# Altium schematic sheet sch_alim.SchDoc: Gestion des alimentations
size A4; CheckedBy: Q.V. Nguyen; Author: Q.V. Nguyen, C. Demasson; DrawnBy: Q.V. Nguyen, C. Demasson; Organization: CNES; DocumentNumber: 1; Revision: 0; SheetNumber: 1; SheetTotal: 4
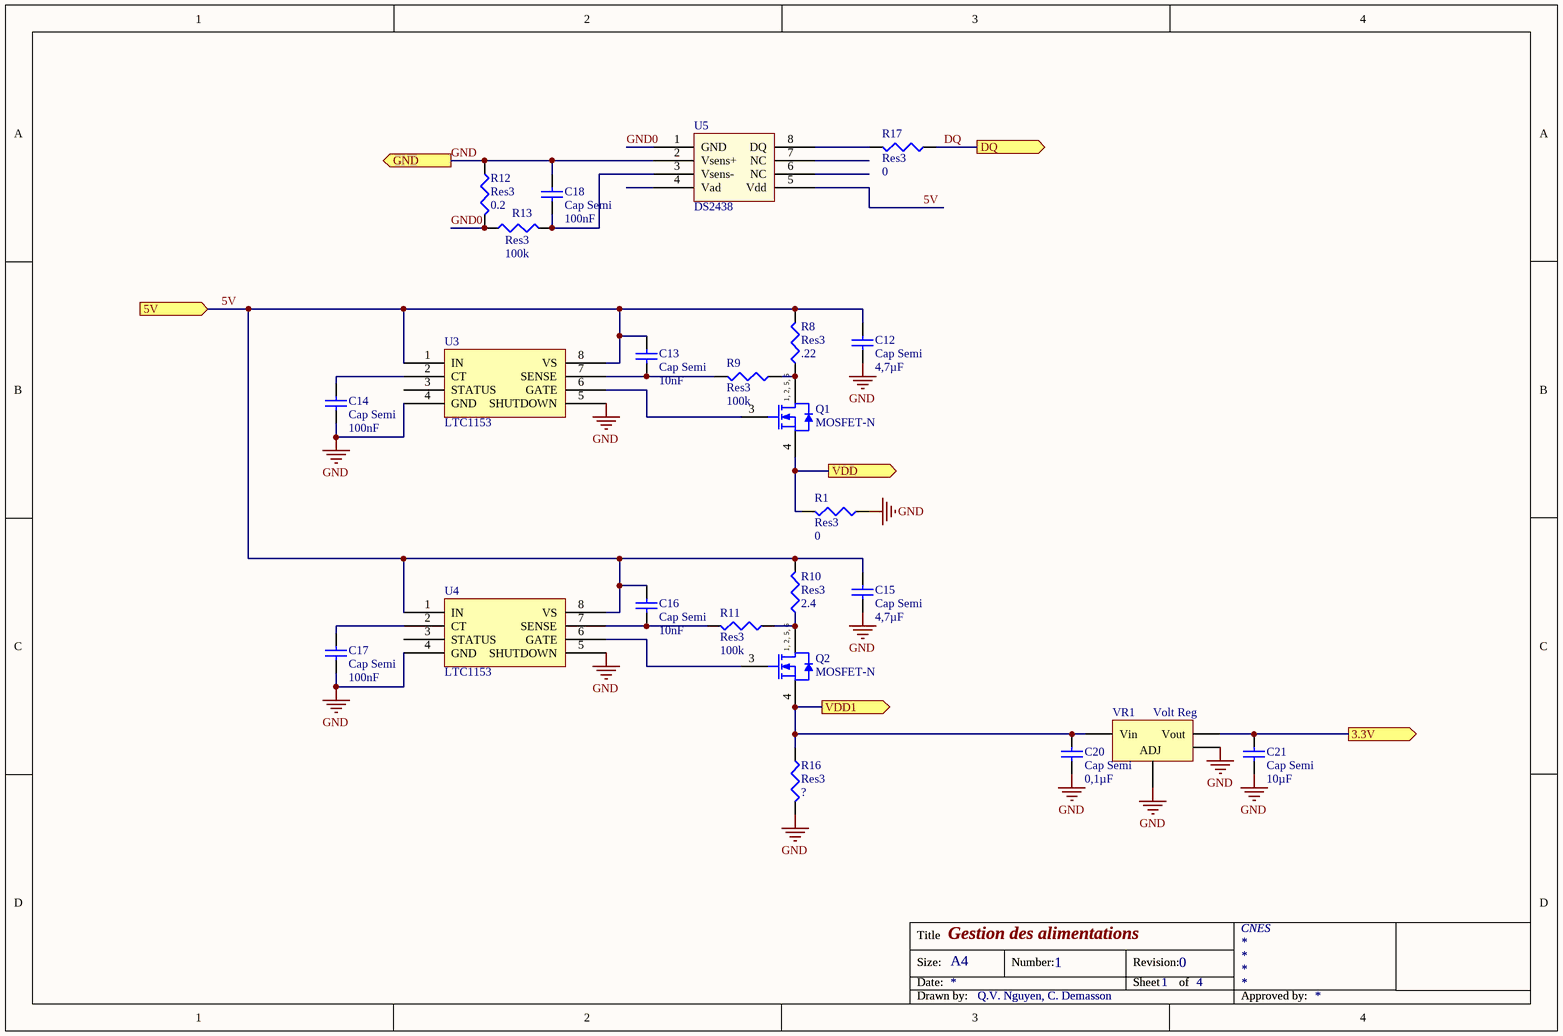
[diagram p0: sch_alim.SchDoc]

## Parts
C12  Cap Semi  value 4,7µF  [C1206]
C13  Cap Semi  value 10nF  [C1206]
C14  Cap Semi  value 100nF  [C1206]
C15  Cap Semi  value 4,7µF  [C1206]
C16  Cap Semi  value 10nF  [C1206]
C17  Cap Semi  value 100nF  [C1206]
C18  Cap Semi  value 100nF  [C1206]
C20  Cap Semi  value 0,1µF  [C1206]
C21  Cap Semi  value 10µF  [C1206]
Q1  MOSFET-N  [ONSC-SC70-6-419B-02_V]
Q2  MOSFET-N  [ONSC-SC70-6-419B-02_V]
R1  Res3  value 0  [C1206]
R8  Res3  value .22  [C1206]
R9  Res3  value 100k  [C1206]
R10  Res3  value 2.4  [C1206]
R11  Res3  value 100k  [C1206]
R12  Res3  value 0.2  [C1206]
R13  Res3  value 100k  [C1206]
R16  Res3  [C1206]
R17  Res3  value 0  [C1206]
U3  LTC1153  [S8 Package]
U4  LTC1153  [S8 Package]
U5  DS2438  [SO8_N]
VR1  Volt Reg  [Reg_LM317]

## Ports
3.3V (out), 5V (in), DQ (out), GND (out), VDD1 (out), VDD (out)

## Nets
GND: C12.2 C14.2 C15.2 C17.2 C18.1 C20.2 C21.2 R1.1 R12.1 R16.2 U3.4(GND) U3.5(SHUTDOWN) U4.4(GND) U4.5(SHUTDOWN) U5.2(Vsens+) VR1.2(ADJ) VR1.4(Vout) ; port GND
3.3V: C21.1 VR1.3(Vout) ; port 3.3V
5V: C12.1 C13.1 C15.1 C16.1 R8.2 R10.2 U3.1(IN) U3.8(VS) U4.1(IN) U4.8(VS) U5.5(Vdd) ; port 5V
DQ: R17.1 ; port DQ
GND0: R12.2 R13.1 U5.1(GND)
VDD: Q1.4(S) R1.2 ; port VDD
VDD1: C20.1 Q2.4(S) R16.1 VR1.1(Vin) ; port VDD1
NetC13_2: C13.2 R9.2 U3.7(SENSE)
NetC14_1: C14.1 U3.2(CT)
NetC16_2: C16.2 R11.2 U4.7(SENSE)
NetC17_1: C17.1 U4.2(CT)
NetC18_2: C18.2 R13.2 U5.3(Vsens-)
NetQ1_1: Q1.1(D) Q1.2(D) Q1.5(D) Q1.6(D) R8.1 R9.1
NetQ1_3: Q1.3(G) U3.6(GATE)
NetQ2_1: Q2.1(D) Q2.2(D) Q2.5(D) Q2.6(D) R10.1 R11.1
NetQ2_3: Q2.3(G) U4.6(GATE)
NetR17_2: R17.2 U5.8(DQ)

Not connected (* = marked no-connect by the designer): U3 3(STATUS); U4 3(STATUS); U5 4(Vad) 6(NC) 7(NC)

## Notes on the sheet
- Title
- Size:
- Date:
- A4
- Number:
- Revision:
- Sheet
- of
- Drawn by:
- Approved by:
- (in symbol CMP-1058-00626-1) 1, 2, 5, 6

## Library data of the parts
C12-C18 C20 C21 = Cap Semi: Capacitor (Semiconductor SIM Model); Published: 8-Jun-2000; LatestRevisionDate: 29-May-2009; LatestRevisionNote: IPC-7351 Footprint Added.; PackageReference: C1206; Publisher: Altium Limited; PackageDescription: Chip Capacitor
Q1 Q2 = CMP-1058-00626-1: Trench Power MOSFET, 20 V, 4 A, Single N-Channel, 6-Pin SC70, Pb-Free, Tape and Reel; PartNumber: NTJS3157NT2G; Manufacturer: On Semiconductor; Qrr Typ (nC): 5; Channel Polarity: N Channel; Crss Typ (pF): 60; VGS Max (V): 8; V(BR)DSS Min (V): 20; Ciss Typ (pF): 500; Coss Typ (pF): 75; ID Max (A): 4; PD Max (W): 1; ComponentLink2Description: Datasheet; ComponentLink1URL: http://www.onsemi.com/; ComponentLink3Description: Package Specification; PackageVersion: Rev. Y, 12/2012; ComponentLink1Description: Manufacturer URL; RoHS: Pb-Free; PackageReference: SC70-6-419B-02; Mounting Technology: Surface Mount; Packing: Tape and Reel; DatasheetVersion: Rev. 3; PackageDescription: 6-Pin Small Outline Transistor, Body 2 x 1.25 mm, Pitch 0.65 mm; ComponentLink3URL: http://www.onsemi.com/pub_link/Collateral/419B-02.PDF; Package Type: SC-88-6 / SC-70-6 / SOT-363-6; Configuration: Single; VGS(th) Max (V): 1; ComponentLink2URL: http://www.onsemi.com/pub_link/Collateral/NTJS3157N-D.PDF
R1 R8-R13 R16 R17 = Res3: Resistor; Published: 8-Jun-2000; LatestRevisionDate: 29-May-2009; LatestRevisionNote: IPC-7351 Footprint Added.; PackageReference: J1-0603; Publisher: Altium Limited; PackageDescription: Chip Resistor
  R16: Value: ?
U5 = DS2438: Battery Monitor
VR1 = Volt Reg: Voltage Regulator; Published: 24-Mar-1999; LatestRevisionDate: 29-May-2009; LatestRevisionNote: IPC-7351 Footprint Added.; PackageReference: D2PAK; Publisher: Altium Limited; PackageDescription: 3-Pin Transistor Outline Package 2.54 mm Pitch, 15.1 mm Lead Span